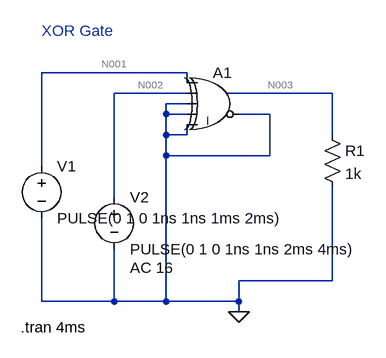
[diagram p0: schematic EEE_LG_6.asc]
EEE_LG_6.asc, the LTspice schematic file:
Version 4
SHEET 1 880 680
WIRE 160 32 -64 32
WIRE 160 48 160 32
WIRE 160 64 48 64
WIRE 384 64 224 64
WIRE 160 80 128 80
WIRE 128 96 128 80
WIRE 160 96 128 96
WIRE 288 96 240 96
WIRE 128 128 128 96
WIRE 160 128 160 112
WIRE 160 128 128 128
WIRE 384 128 384 64
WIRE 128 160 128 128
WIRE 288 160 288 96
WIRE 288 160 128 160
WIRE -64 176 -64 32
WIRE 48 224 48 64
WIRE 384 352 384 208
WIRE 384 352 240 352
WIRE -64 384 -64 256
WIRE 48 384 48 304
WIRE 48 384 -64 384
WIRE 128 384 128 160
WIRE 128 384 48 384
WIRE 240 384 240 352
WIRE 240 384 128 384
WIRE 240 400 240 384
FLAG 240 400 0
SYMBOL voltage -64 160 R0
WINDOW 123 0 0 Left 0
WINDOW 39 0 0 Left 0
SYMATTR InstName V1
SYMATTR Value PULSE(0 1 0 1ns 1ns 1ms 2ms)
SYMBOL voltage 48 208 R0
WINDOW 123 24 124 Left 2
WINDOW 39 0 0 Left 0
SYMATTR Value2 AC 16
SYMATTR InstName V2
SYMATTR Value PULSE(0 1 0 1ns 1ns 2ms 4ms)
SYMBOL res 368 112 R0
SYMATTR InstName R1
SYMATTR Value 1k
SYMBOL Digital\\xor 208 16 R0
SYMATTR InstName A1
TEXT -64 -32 Left 2 ;XOR Gate
TEXT -96 424 Left 2 !.tran 4ms

The netlist it stands for:
* EEE_LG_6.asc
V1 N001 0 PULSE(0 1 0 1ns 1ns 1ms 2ms)
V2 N002 0 PULSE(0 1 0 1ns 1ns 2ms 4ms) AC 16
R1 N003 0 1k
A1 N001 N002 0 0 0 0 N003 0 XOR
* XOR Gate
.tran 4ms
.backanno
.end

* Results of the author's LTspice run, read from the files saved beside the schematic
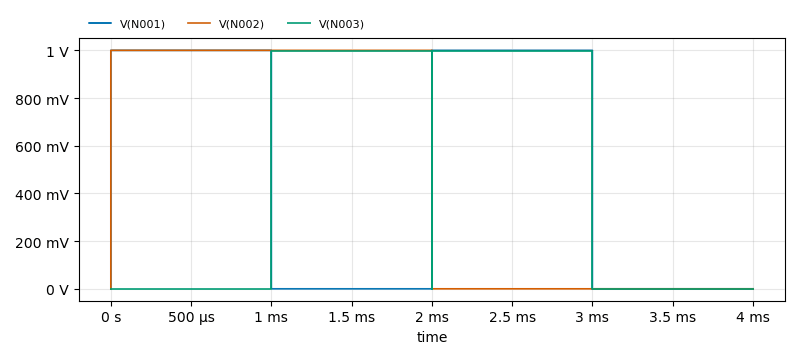
[diagram p1: Transient Analysis of EEE_LG_6.asc, plotted from the saved traces]
* Transient Analysis, 1 run:
*   V(N001): min 0 V, max 1 V, average 500 mV, rms 707.1 mV, last 0 V
*   V(N002): min 0 V, max 1 V, average 500 mV, rms 707.1 mV, last 0 V
*   V(N003): min 0 V, max 999 mV, average 499.5 mV, rms 706.4 mV, last 0 V